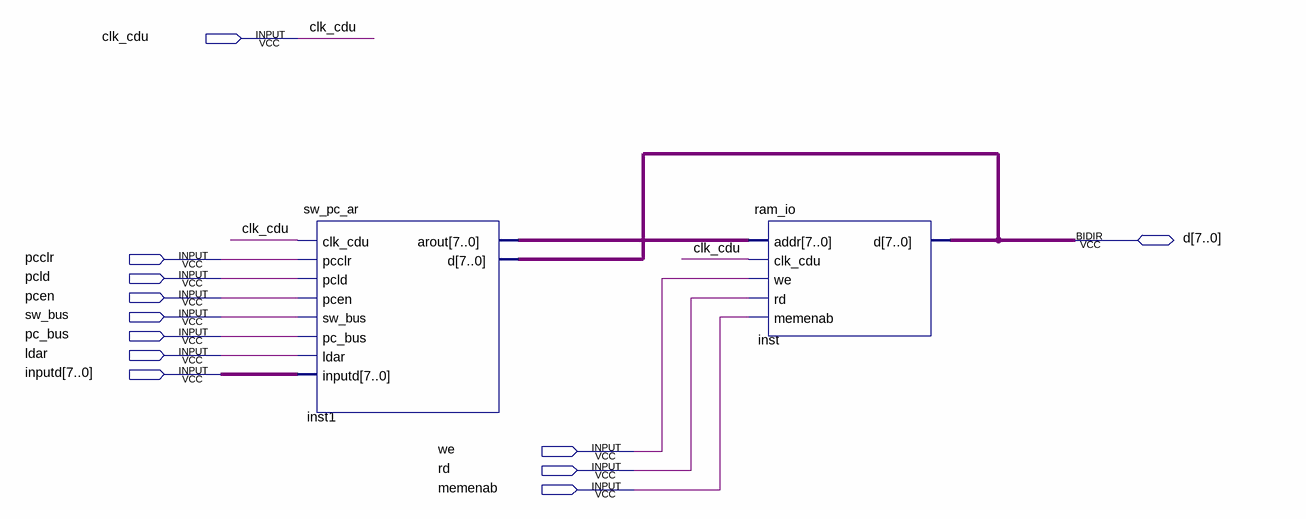
[diagram p0: schematic sheet]
// Quartus schematic ccq_8.bdf as structural Verilog: 2 symbols, 12 pins
module ccq_8 (
  input  clk_cdu,
  input  pcclr,
  input  pcld,
  input  pcen,
  input  sw_bus,
  input  pc_bus,
  input  ldar,
  input  [7:0] inputd,
  input  we,
  input  rd,
  input  memenab,
  inout  [7:0] d
);

  wire [7:0] inst1_arout;

  sw_pc_ar inst1 (
    .clk_cdu(clk_cdu), .pcclr(pcclr), .pcld(pcld), .pcen(pcen), .sw_bus(sw_bus), .pc_bus(pc_bus),
    .ldar(ldar), .inputd(inputd), .arout(inst1_arout), .d(d));
  ram_io inst (.addr(inst1_arout), .clk_cdu(clk_cdu), .we(we), .rd(rd), .memenab(memenab), .d(d));
endmodule
